# Altium schematic sheet 10-multimodal-combined-sensor.SchDoc
size A4; SheetNumber: 11; SheetTotal: 12
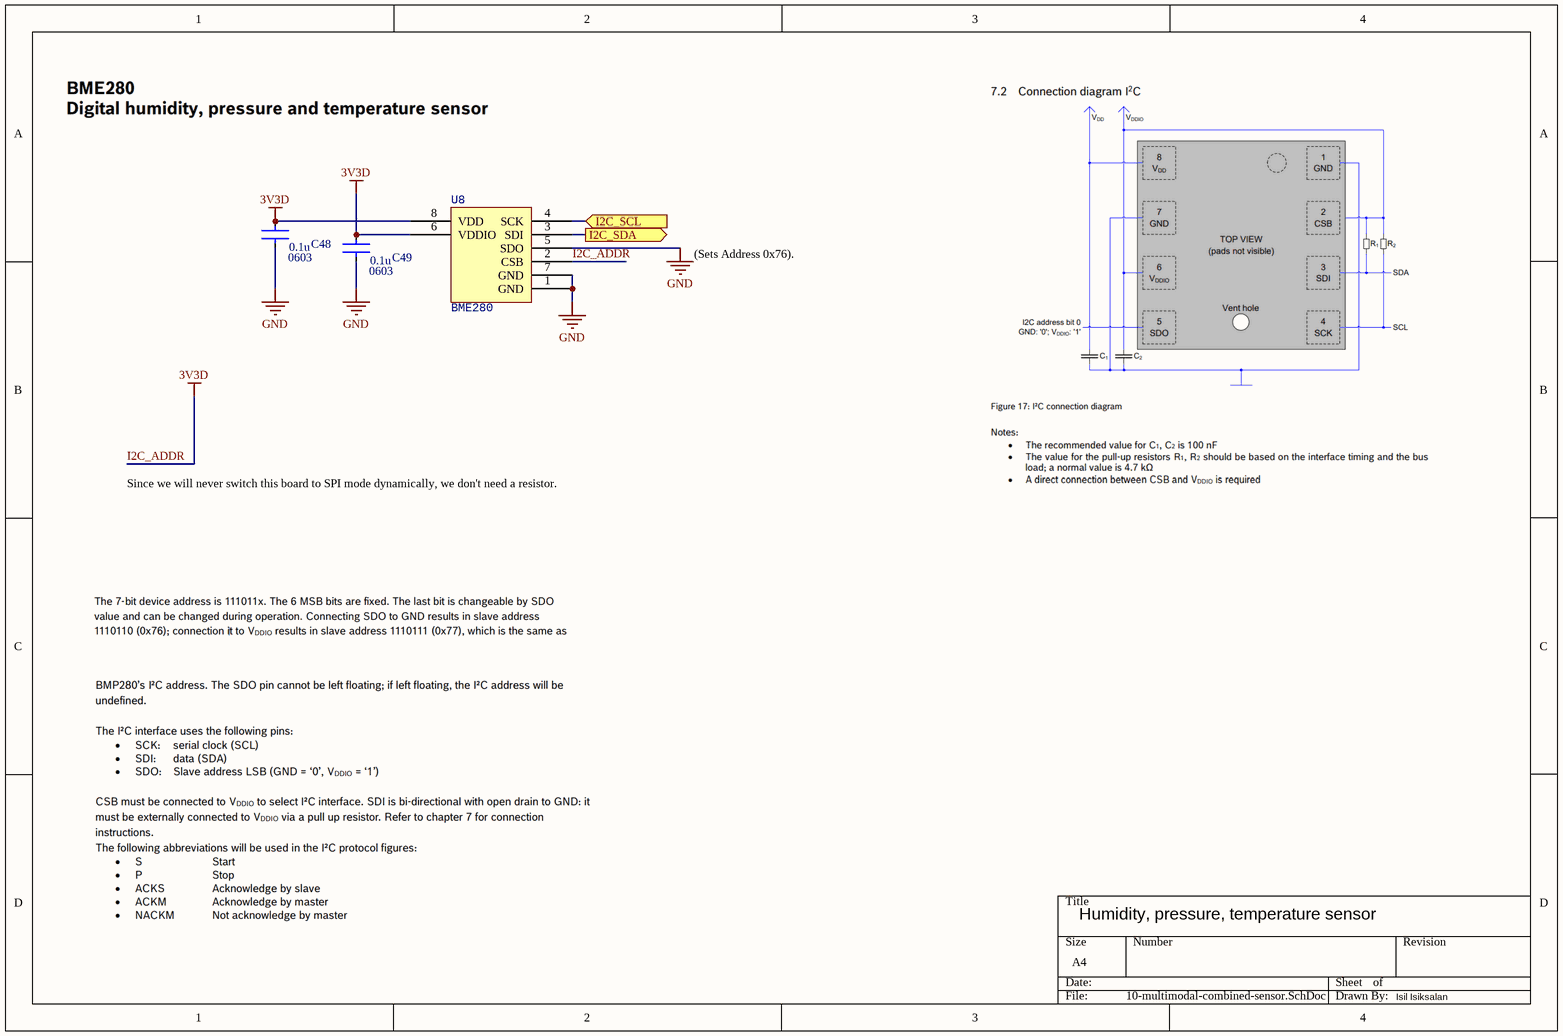
[diagram p0: 10-multimodal-combined-sensor.SchDoc]

## Parts
C48  CGA3E2X7R1H104K080AA  [CAPTDK0603]  (value not drawn)
C49  CGA3E2X7R1H104K080AA  [CAPTDK0603]  (value not drawn)
U8  BME280  [BME280]

## Ports
I2C_SCL (in), I2C_SDA (out)

## Nets
GND: C48.2 C49.2 U8.1(GND) U8.5(SDO) U8.7(GND)
I2C_ADDR: C48.1 C49.1 U8.2(CSB) U8.6(VDDIO) U8.8(VDD)  [also labelled 3V3D]
I2C_SCL: U8.4(SCK) ; port I2C_SCL
I2C_SDA: U8.3(SDI) ; port I2C_SDA

## Notes on the sheet
- (Sets Address 0x76).
- Since we will never switch this board to SPI mode dynamically, we don't need a resistor.
- Humidity, pressure, temperature sensor
- Isil Isiksalan
- (in symbol CGA3E2X7R1H104K080AA) 0.1u; 0603

## Library data of the parts
C48 C49 = CGA3E2X7R1H104K080AA: CAP CER 0.1UF 50V X7R 0603; Supplier 1: Digi-Key; Supplier Part Number 1: 445-5666-1-ND
U8 = BME280: SENSOR PRESSURE HUMIDITY TEMP Humidity, Pressure, Temperature 0 ~ 100% RH I2C, SPI ±3% 1 s Surface Mount